# EAGLE design pi3-MotherBoard-rev2 (EAGLE 7.6.0)

## Sheet 1 of 2
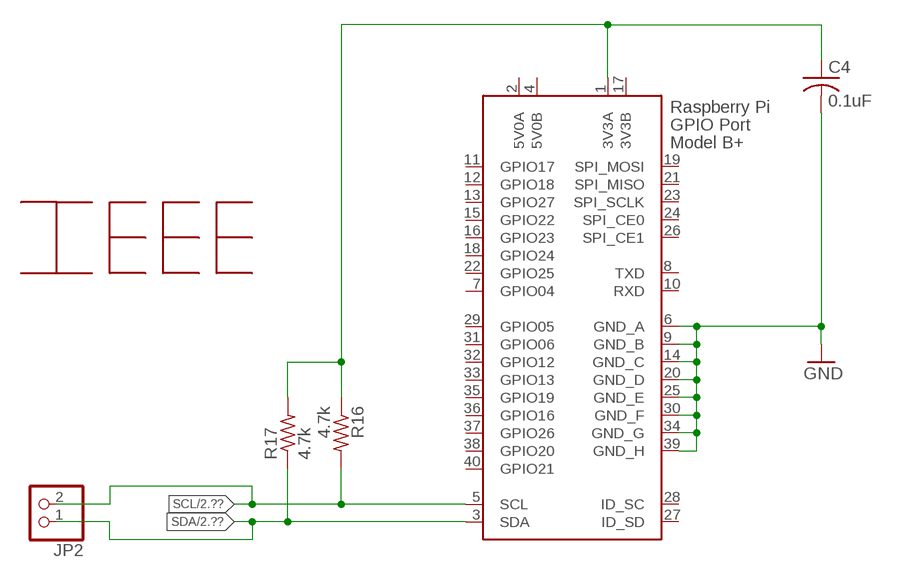
[diagram p0: schematic, sheet 1]

### Parts
C4  0.1uF  C-USC0805  [C0805]
JP2  PINHD-1X2  [1X02]
R16  4.7k  R-US_R1206  [R1206]
R17  4.7k  R-US_R1206  [R1206]
U$1  LOGO  [IEEE-LOGO]
X1  RASPI_BOARD_B+#_FP  [RASPI_BOARD_B+_FULL_PAD]

### Nets
+3V3: C4.1 R16.1 R17.2 X1.1(3V3A) ; also sheet 2
GND: C4.2 X1.6(GND_A) X1.9(GND_B) X1.14(GND_C) X1.20(GND_D) X1.25(GND_E) X1.30(GND_F) X1.34(GND_G) X1.39(GND_H) ; also sheet 2
SCL: JP2.2 R16.2 X1.5(SCL) ; also sheet 2
SDA: JP2.1 R17.1 X1.3(SDA) ; also sheet 2
Unconnected: X1.7(GPIO04) X1.8(TXD) X1.10(RXD) X1.11(GPIO17) X1.12(GPIO18) X1.13(GPIO27) X1.15(GPIO22) X1.16(GPIO23) X1.18(GPIO24) X1.19(SPI_MOSI) X1.21(SPI_MISO) X1.22(GPIO25) X1.23(SPI_SCLK) X1.24(SPI_CE0) X1.26(SPI_CE1) X1.27(ID_SD) X1.28(ID_SC) X1.29(GPIO05) X1.31(GPIO06) X1.32(GPIO12) X1.33(GPIO13) X1.35(GPIO19) X1.36(GPIO16) X1.37(GPIO26) X1.38(GPIO20) X1.40(GPIO21)

## Sheet 2 of 2
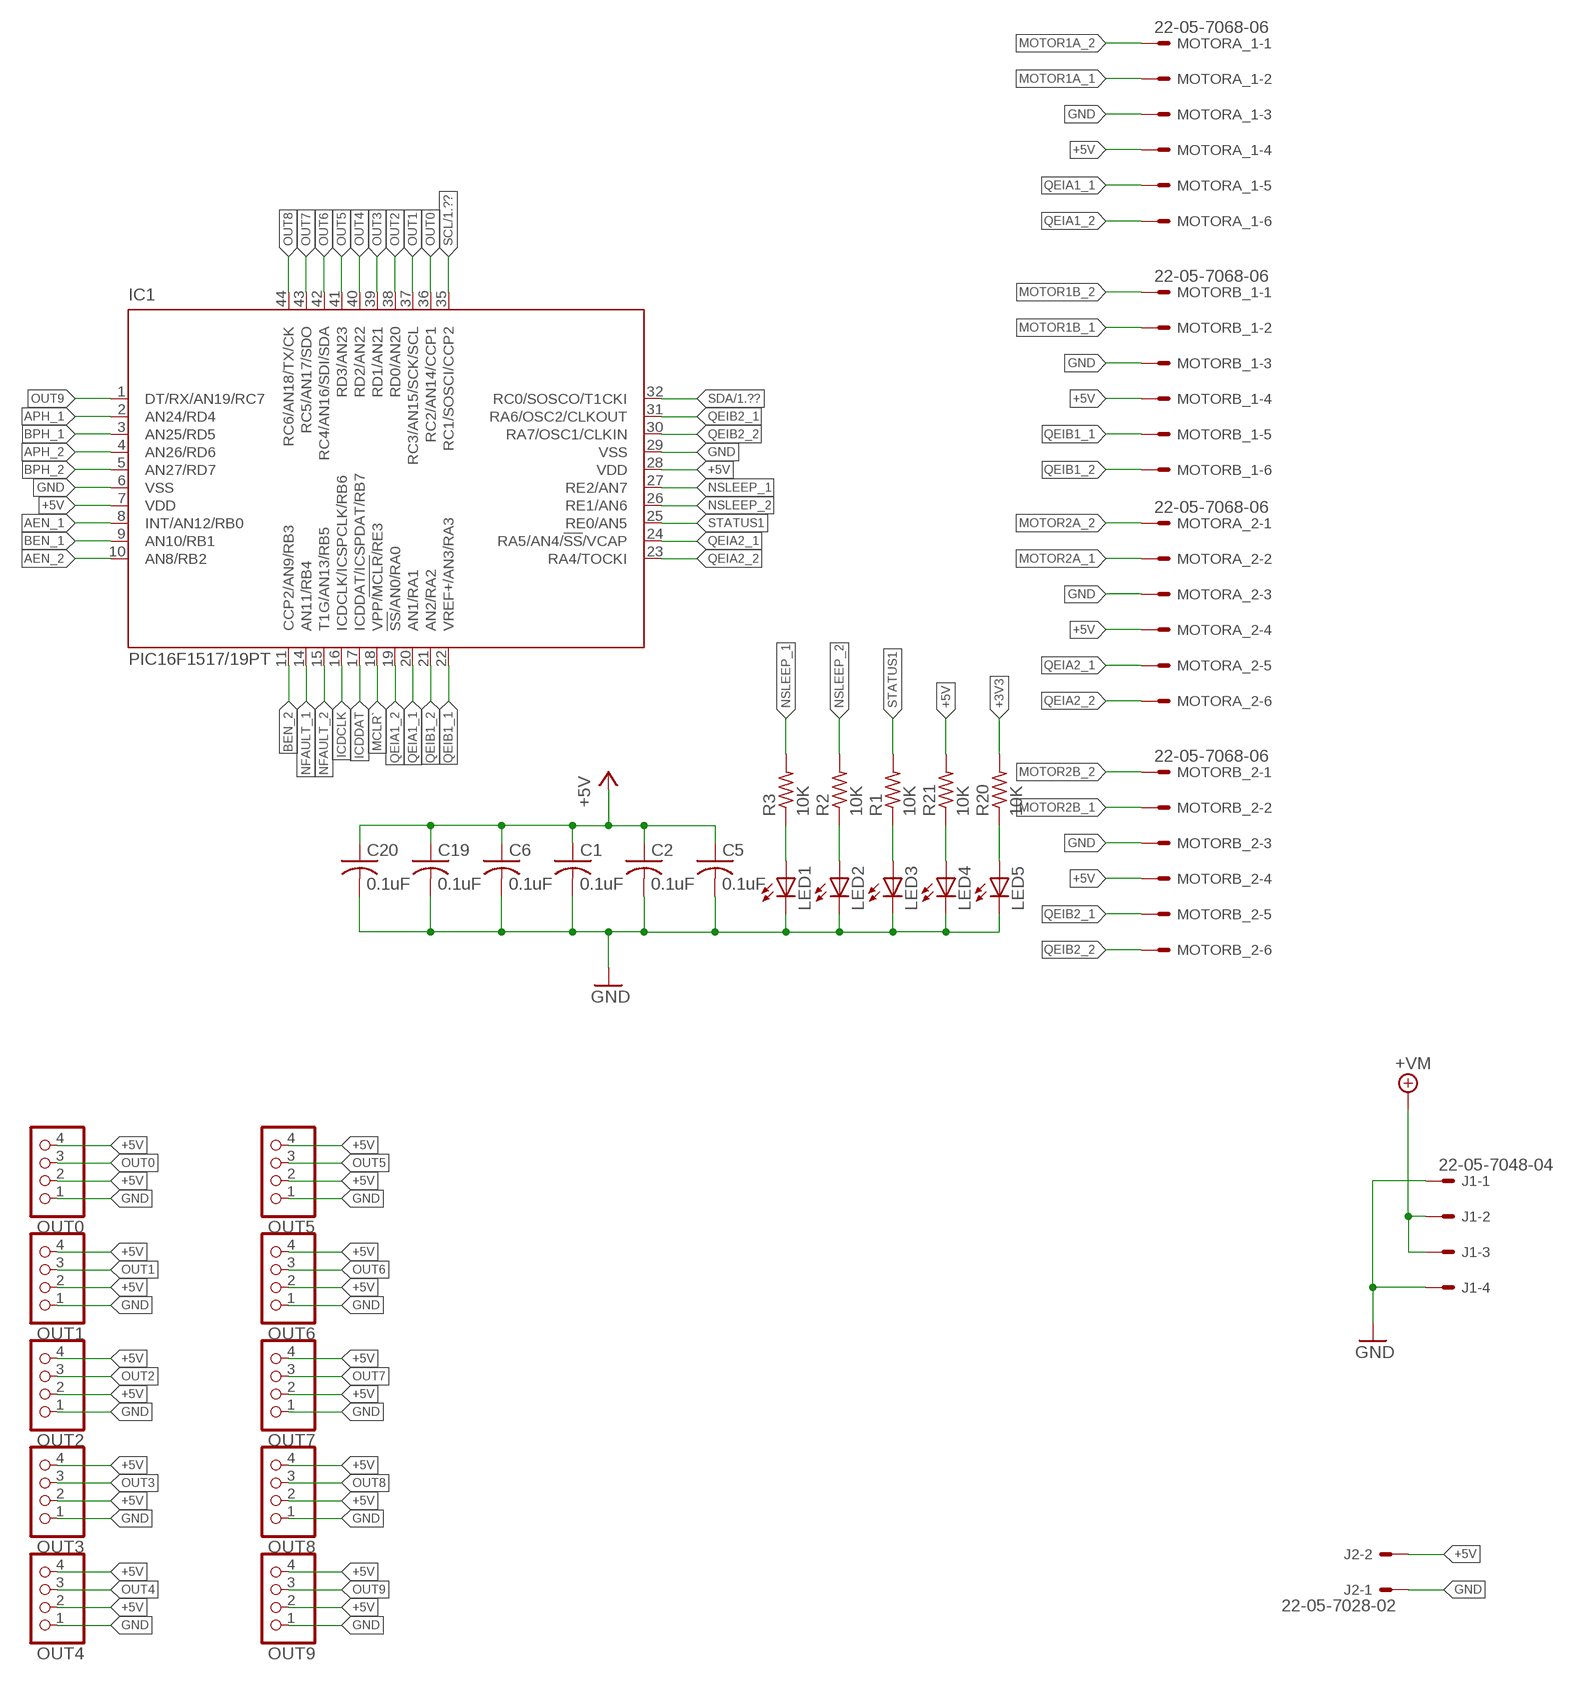
[diagram p1: schematic, sheet 2, part 1 of 2]
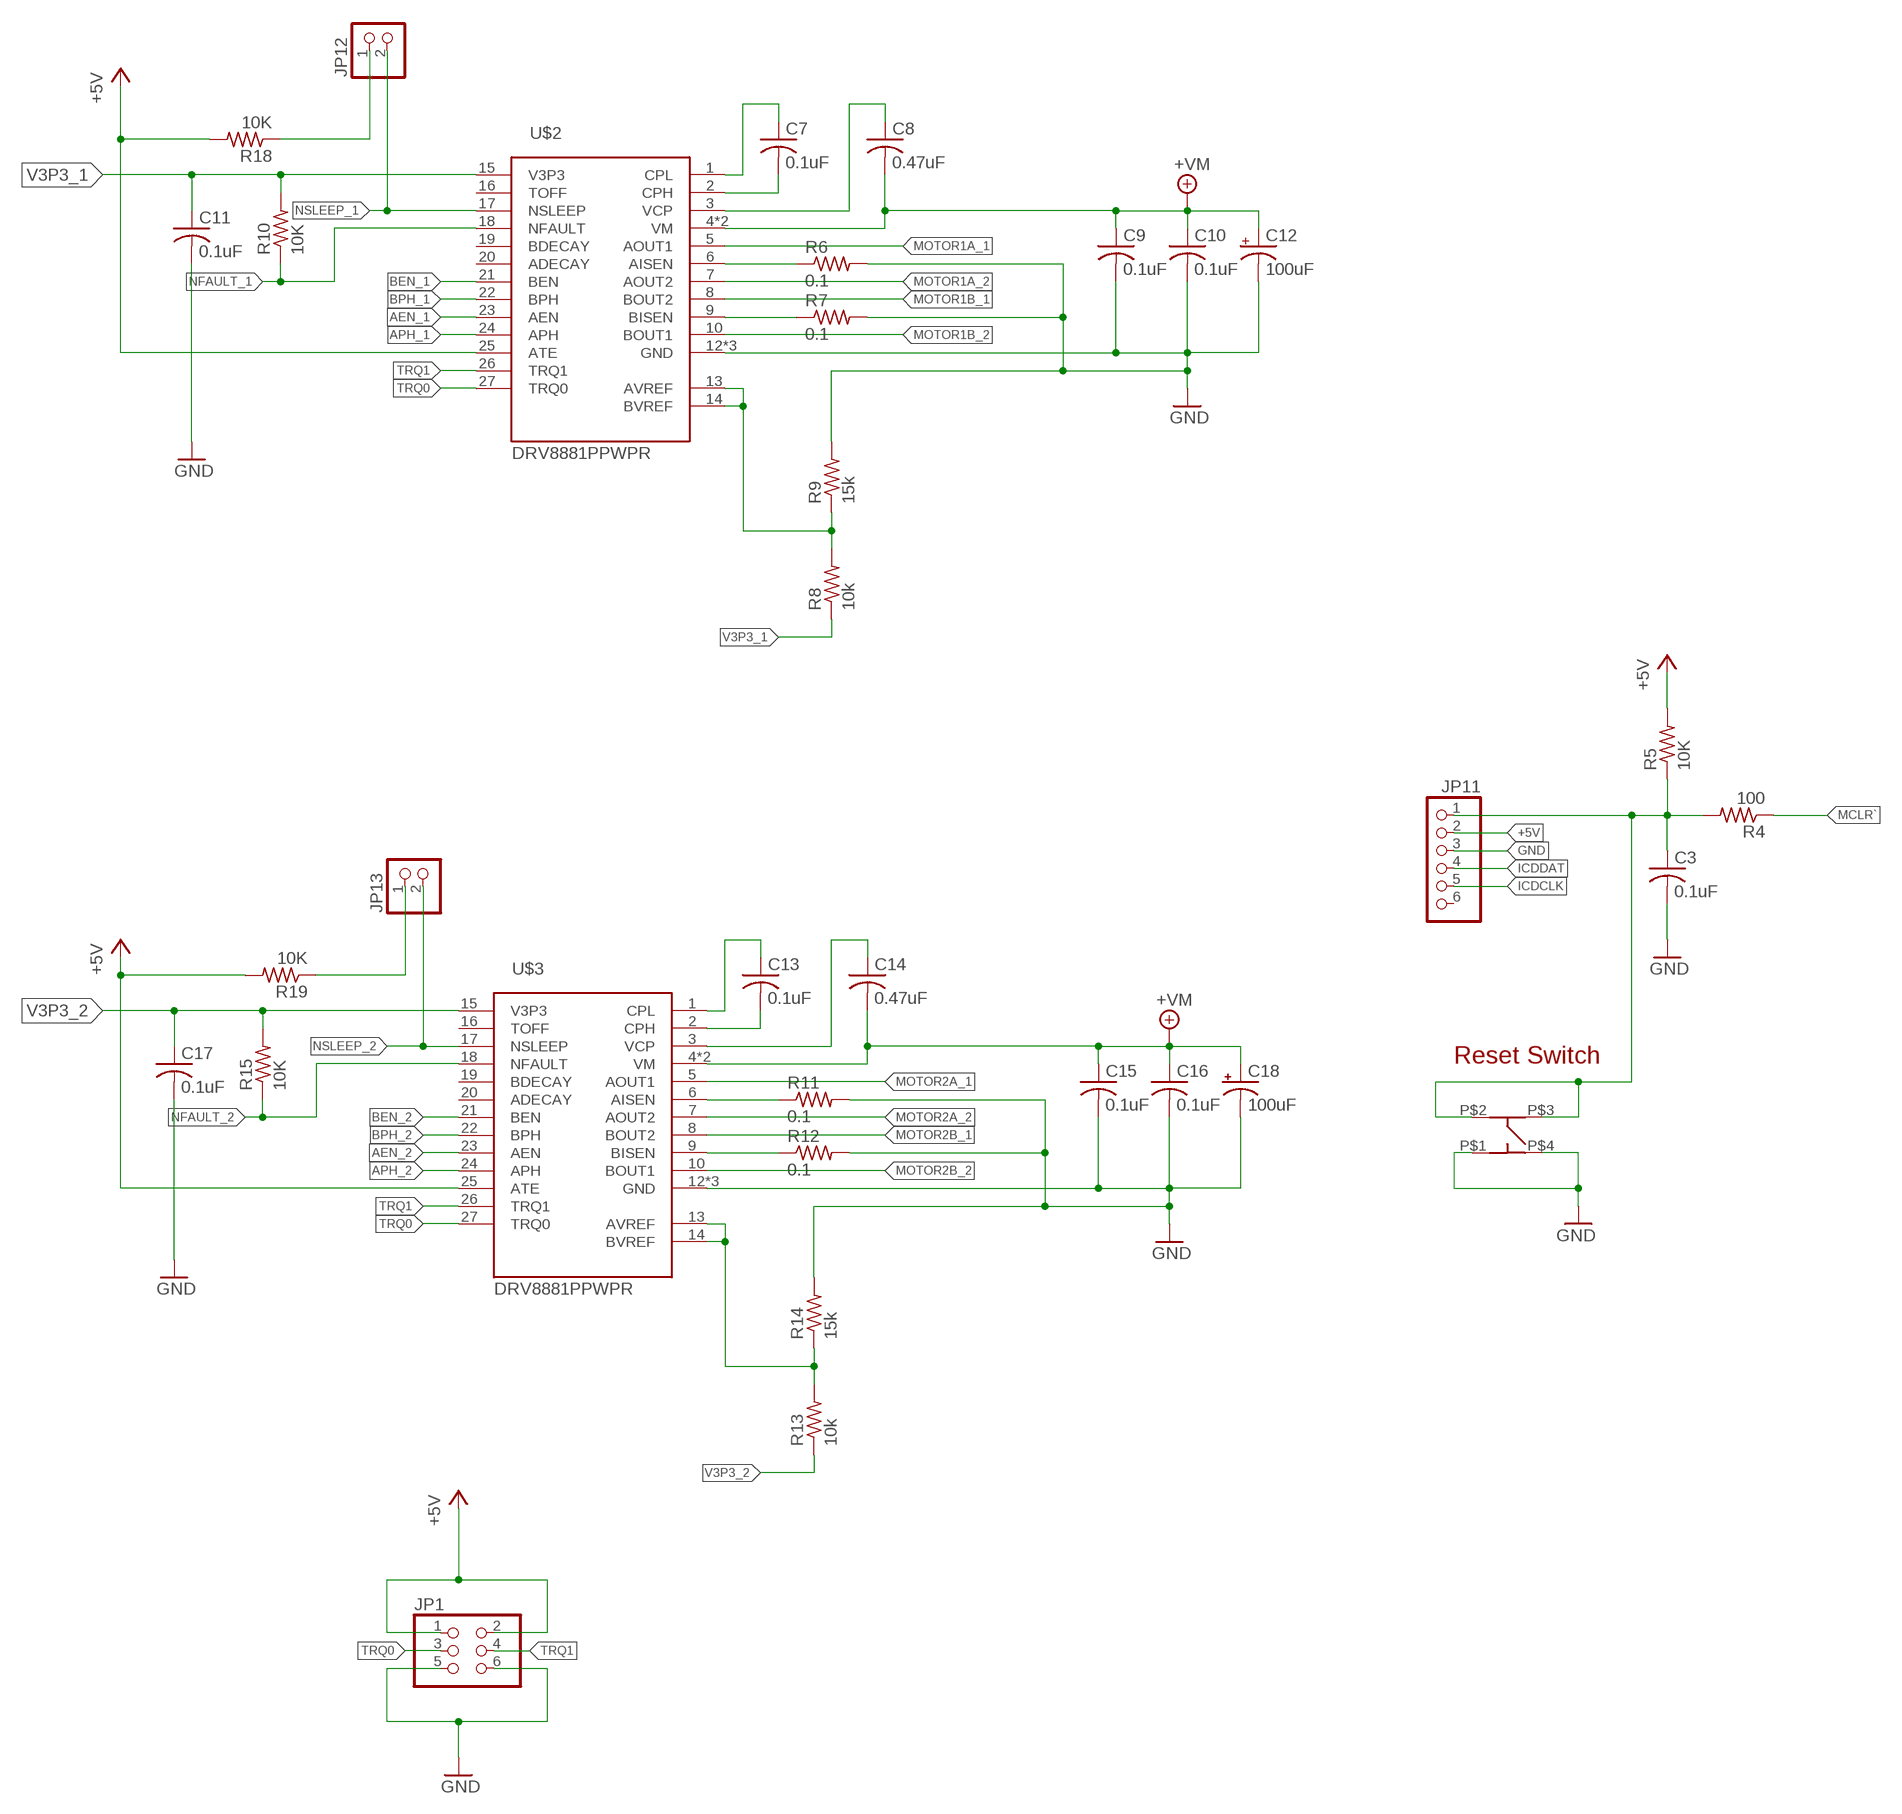
[diagram p2: schematic, sheet 2, part 2 of 2]

### Parts
C1  0.1uF  C-USC0805  [C0805]
C2  0.1uF  C-USC0805  [C0805]
C3  0.1uF  C-USC0805  [C0805]
C5  0.1uF  C-USC0805  [C0805]
C6  0.1uF  C-USC0805  [C0805]
C7  0.1uF  C-USC0402  [C0402]
C8  0.47uF  C-USC0402  [C0402]
C9  0.1uF  C-USC0402  [C0402]
C10  0.1uF  C-USC0402  [C0402]
C11  0.1uF  C-USC0402  [C0402]
C12  100uF  100UF-10V-10%(TANT)  [EIA7343]
C13  0.1uF  C-USC0402  [C0402]
C14  0.47uF  C-USC0402  [C0402]
C15  0.1uF  C-USC0402  [C0402]
C16  0.1uF  C-USC0402  [C0402]
C17  0.1uF  C-USC0402  [C0402]
C18  100uF  100UF-10V-10%(TANT)  [EIA7343]
C19  0.1uF  C-USC0805  [C0805]
C20  0.1uF  C-USC0805  [C0805]
IC1  PIC16F1517/19PT  [TQFP44]
J1  22-05-7048-04  [7395-04]
J2  22-05-7028-02  [7395-02]
JP1  PINHD-2X3  [2X03]
JP11  PINHD-1X6/90  [1X06/90]
JP12  PINHD-1X2  [1X02]
JP13  PINHD-1X2  [1X02]
LED1  LEDSML0603  [SML0603]
LED2  LEDSML0603  [SML0603]
LED3  LEDSML0603  [SML0603]
LED4  LEDSML0603  [SML0603]
LED5  LEDSML0603  [SML0603]
MOTORA_1  22-05-7068-06  [7395-06]
MOTORA_2  22-05-7068-06  [7395-06]
MOTORB_1  22-05-7068-06  [7395-06]
MOTORB_2  22-05-7068-06  [7395-06]
OUT0  PINHD-1X4  [1X04]
OUT1  PINHD-1X4  [1X04]
OUT2  PINHD-1X4  [1X04]
OUT3  PINHD-1X4  [1X04]
OUT4  PINHD-1X4  [1X04]
OUT5  PINHD-1X4  [1X04]
OUT6  PINHD-1X4  [1X04]
OUT7  PINHD-1X4  [1X04]
OUT8  PINHD-1X4  [1X04]
OUT9  PINHD-1X4  [1X04]
R1  10K  R-US_R1206  [R1206]
R2  10K  R-US_R1206  [R1206]
R3  10K  R-US_R1206  [R1206]
R4  100  R-US_R1206  [R1206]
R5  10K  R-US_R1206  [R1206]
R6  0.1  R-US_R1206  [R1206]
R7  0.1  R-US_R1206  [R1206]
R8  10k  R-US_R0402  [R0402]
R9  15k  R-US_R0402  [R0402]
R10  10K  R-US_R1206  [R1206]
R11  0.1  R-US_R1206  [R1206]
R12  0.1  R-US_R1206  [R1206]
R13  10k  R-US_R0402  [R0402]
R14  15k  R-US_R0402  [R0402]
R15  10K  R-US_R1206  [R1206]
R18  10K  R-US_R1206  [R1206]
R19  10K  R-US_R1206  [R1206]
R20  10K  R-US_R1206  [R1206]
R21  10K  R-US_R1206  [R1206]
TOUCH_RESET  RESET  MC32882_SW  [MC32882_FINAL]
U$2  DRV8881PPWPR  [TSSOP-28]
U$3  DRV8881PPWPR  [TSSOP-28]

### Nets
+3V3: R20.2 ; also sheet 1
+5V: C1.1 C2.1 C5.1 C6.1 C19.1 C20.1 IC1.7(VDD) IC1.28(VDD) J2.2 JP1.1 JP1.2 JP11.2 MOTORA_1.4 MOTORA_2.4 MOTORB_1.4 MOTORB_2.4 OUT0.2 OUT0.4 OUT1.2 OUT1.4 OUT2.2 OUT2.4 OUT3.2 OUT3.4 OUT4.2 OUT4.4 OUT5.2 OUT5.4 OUT6.2 OUT6.4 OUT7.2 OUT7.4 OUT8.2 OUT8.4 OUT9.2 OUT9.4 R5.2 R18.2 R19.2 R21.2 U$2.25(ATE) U$3.25(ATE)
+7V [VM]: C8.2 C9.1 C10.1 C12.A(+) C14.2 C15.1 C16.1 C18.A(+) J1.2 J1.3 U$2.4(VM) U$2.11(VM) U$3.4(VM) U$3.11(VM) ; supply symbol labelled +VM
AEN_1: IC1.8(INT/AN12/RB0) U$2.23(AEN)
AEN_2: IC1.10(AN8/RB2) U$3.23(AEN)
APH_1: IC1.2(AN24/RD4) U$2.24(APH)
APH_2: IC1.4(AN26/RD6) U$3.24(APH)
BEN_1: IC1.9(AN10/RB1) U$2.21(BEN)
BEN_2: IC1.11(CCP2/AN9/RB3) U$3.21(BEN)
BPH_1: IC1.3(AN25/RD5) U$2.22(BPH)
BPH_2: IC1.5(AN27/RD7) U$3.22(BPH)
GND: C1.2 C2.2 C3.2 C5.2 C6.2 C9.2 C10.2 C11.2 C12.C(-) C15.2 C16.2 C17.2 C18.C(-) C19.2 C20.2 IC1.6(VSS) IC1.29(VSS) J1.1 J1.4 J2.1 JP1.5 JP1.6 JP11.3 LED1.C LED2.C LED3.C LED4.C LED5.C MOTORA_1.3 MOTORA_2.3 MOTORB_1.3 MOTORB_2.3 OUT0.1 OUT1.1 OUT2.1 OUT3.1 OUT4.1 OUT5.1 OUT6.1 OUT7.1 OUT8.1 OUT9.1 R6.2 R7.2 R9.2 R11.2 R12.2 R14.2 TOUCH_RESET.P$1(P1) TOUCH_RESET.P$4(P4) U$2.12(GND) U$2.28(GND) U$2.EXP(GND) U$3.12(GND) U$3.28(GND) U$3.EXP(GND) ; also sheet 1
ICDCLK: IC1.16(ICDCLK/ICSPCLK/RB6) JP11.5
ICDDAT: IC1.17(ICDDAT/ICSPDAT/RB7) JP11.4
MCLR: C3.1 JP11.1 R4.2 R5.1 TOUCH_RESET.P$2(P2) TOUCH_RESET.P$3(P3)
MCLR`: IC1.18(VPP/!MCLR!/RE3) R4.1
MOTOR1A_1: MOTORA_1.2 U$2.5(AOUT1)
MOTOR1A_2: MOTORA_1.1 U$2.7(AOUT2)
MOTOR1B_1: MOTORB_1.2 U$2.8(BOUT2)
MOTOR1B_2: MOTORB_1.1 U$2.10(BOUT1)
MOTOR2A_1: MOTORA_2.2 U$3.5(AOUT1)
MOTOR2A_2: MOTORA_2.1 U$3.7(AOUT2)
MOTOR2B_1: MOTORB_2.2 U$3.8(BOUT2)
MOTOR2B_2: MOTORB_2.1 U$3.10(BOUT1)
N$1: LED3.A R1.1
N$2: JP12.1 R18.1
N$3: JP13.1 R19.1
N$4: R7.1 U$2.9(BISEN)
N$5: LED5.A R20.1
N$6: LED2.A R2.1
N$7: LED1.A R3.1
N$8: LED4.A R21.1
N$11: R6.1 U$2.6(AISEN)
N$16: C7.2 U$2.2(CPH)
N$17: C7.1 U$2.1(CPL)
N$19: C8.1 U$2.3(VCP)
N$20: R8.2 R9.1 U$2.13(AVREF) U$2.14(BVREF)
N$21: R12.1 U$3.9(BISEN)
N$22: R11.1 U$3.6(AISEN)
N$27: C13.2 U$3.2(CPH)
N$28: C13.1 U$3.1(CPL)
N$29: C14.1 U$3.3(VCP)
N$30: R13.2 R14.1 U$3.13(AVREF) U$3.14(BVREF)
NFAULT_1: IC1.14(AN11/RB4) R10.1 U$2.18(NFAULT)
NFAULT_2: IC1.15(T1G/AN13/RB5) R15.1 U$3.18(NFAULT)
NSLEEP_1: IC1.27(RE2/AN7) JP12.2 R3.2 U$2.17(NSLEEP)
NSLEEP_2: IC1.26(RE1/AN6) JP13.2 R2.2 U$3.17(NSLEEP)
OUT0: IC1.36(RC2/AN14/CCP1) OUT0.3
OUT1: IC1.37(RC3/AN15/SCK/SCL) OUT1.3
OUT2: IC1.38(RD0/AN20) OUT2.3
OUT3: IC1.39(RD1/AN21) OUT3.3
OUT4: IC1.40(RD2/AN22) OUT4.3
OUT5: IC1.41(RD3/AN23) OUT5.3
OUT6: IC1.42(RC4/AN16/SDI/SDA) OUT6.3
OUT7: IC1.43(RC5/AN17/SDO) OUT7.3
OUT8: IC1.44(RC6/AN18/TX/CK) OUT8.3
OUT9: IC1.1(DT/RX/AN19/RC7) OUT9.3
QEIA1_1: IC1.20(AN1/RA1) MOTORA_1.5
QEIA1_2: IC1.19(!SS!/AN0/RA0) MOTORA_1.6
QEIA2_1: IC1.24(RA5/AN4/!SS!/VCAP) MOTORA_2.5
QEIA2_2: IC1.23(RA4/TOCKI) MOTORA_2.6
QEIB1_1: IC1.22(VREF+/AN3/RA3) MOTORB_1.5
QEIB1_2: IC1.21(AN2/RA2) MOTORB_1.6
QEIB2_1: IC1.31(RA6/OSC2/CLKOUT) MOTORB_2.5
QEIB2_2: IC1.30(RA7/OSC1/CLKIN) MOTORB_2.6
SCL: IC1.35(RC1/SOSCI/CCP2) ; also sheet 1
SDA: IC1.32(RC0/SOSCO/T1CKI) ; also sheet 1
STATUS1: IC1.25(RE0/AN5) R1.2
TRQ0: JP1.3 U$2.27(TRQ0) U$3.27(TRQ0)
TRQ1: JP1.4 U$2.26(TRQ1) U$3.26(TRQ1)
V3P3_1: C11.1 R8.1 R10.2 U$2.15(V3P3)
V3P3_2: C17.1 R13.1 R15.2 U$3.15(V3P3)
Unconnected: JP11.6 U$2.16(TOFF) U$2.19(BDECAY) U$2.20(ADECAY) U$3.16(TOFF) U$3.19(BDECAY) U$3.20(ADECAY)

### Notes on the sheet
- Reset Switch

## Power pins joined to a net without a drawn wire
3V3B: X1.17(3V3B)
5V0A: X1.2(5V0A)
5V0B: X1.4(5V0B)

## Library data of the parts
C1-C11 C13-C17 C19 C20 = rcl:C-US: CAPACITOR, American symbol
C12 C18 = SparkFun-Capacitors:100UF-10V-10%(TANT): CAP-07890; PROD_ID: CAP-07890
IC1 = microchip:PIC16*F1517/19: 28/40/44-Pin Flash Microcontrollers with nanoWatt XLP Technology PIC16F1517/1519 AND PIC16LF1517/1519 Source: www.microchip.com PIC16F1516.pdf
J1 = con-molex:22-?-04: CONNECTOR wire to board 2.54 mm (.1 inch) pitch header; OC_FARNELL: unknown; OC_NEWARK: unknown
J2 = con-molex:22-?-02: CONNECTOR wire to board 2.54 mm (.1 inch) pitch header; OC_FARNELL: 9731601; OC_NEWARK: unknown
JP1 = pinhead:PINHD-2X3: PIN HEADER
JP2 JP12 JP13 = pinhead:PINHD-1X2: PIN HEADER
JP11 = pinhead:PINHD-1X6: PIN HEADER
LED1-LED5 = interface_board-rev13:LED: LED OSRAM: - CHIPLED LG R971, LG N971, LY N971, LG Q971, LY Q971, LO R971, LY R971 LH N974, LH R974 LS Q976, LO Q976, LY Q976 LO Q996 - Hyper CHIPLED LW Q18S LB Q993, LB Q99A, LB R99A - SideLED LS A670, LO A670, LY A670, LG A670, LP A670 LB A673, LV A673, LT A673, LW A673 LH A674 LY A675 LS A676, LA A676, LO A676, LY A676, LW A676 LS A679, LY A679, LG A679 - Hyper Micro SIDELED® LS Y876, LA Y876, LO Y876, LY Y876 LT Y87S - SmartLED LW L88C, LW L88S LB L89C, LB L89S, LG L890 LS L89K, LO L89K, LY L89K LS L896, LA L896, LO L896, LY L896 - TOPLED LS T670, LO T670, LY T670, LG T670, LP T670 LSG T670, LSP T670, LSY T670, LOP T670, LYG T670 LG T671, LOG T671, LSG T671 LB T673, LV T673, LT T673, LW T673 LH T674 LS T676, LA T676, LO T676, LY T676, LB T676, LH T676, LSB T676, LW T676 LB T67C, LV T67C, LT T67C, LS T67K, LO T67K, LY T67K, LW E67C LS E67B, LA E67B, LO E67B, LY E67B, LB E67C, LV E67C, LT E67C LW T67C LS T679, LY T679, LG T679 LS T770, LO T770, LY T770, LG T770, LP T770 LB T773, LV T773, LT T773, LW T773 LH T774 LS E675, LA E675, LY E675, LS T675 LS T776, LA T776, LO T776, LY T776, LB T776 LHGB T686 LT T68C, LB T68C - Hyper Mini TOPLED® LB M676 - Mini TOPLED Santana® LG M470 LS M47K, LO M47K, LY M47K Source: http://www.osram.convergy.de LUXEON: - LUMILED® LXK2-PW12-R00, LXK2-PW12-S00, LXK2-PW14-U00, LXK2-PW14-V00 LXK2-PM12-R00, LXK2-PM12-S00, LXK2-PM14-U00 LXK2-PE12-Q00, LXK2-PE12-R00, LXK2-PE12-S00, LXK2-PE14-T00, LXK2-PE14-U00 LXK2-PB12-K00, LXK2-PB12-L00, LXK2-PB12-M00, LXK2-PB14-N00, LXK2-PB14-P00, LXK2-PB14-Q00 LXK2-PR12-L00, LXK2-PR12-M00, LXK2-PR14-Q00, LXK2-PR14-R00 LXK2-PD12-Q00, LXK2-PD12-R00, LXK2-PD12-S00 LXK2-PH12-R00, LXK2-PH12-S00 LXK2-PL12-P00, LXK2-PL12-Q00, LXK2-PL12-R00 Source: www.luxeon.com KINGBRIGHT: KA-3528ASYC Source: www.kingbright.com
MOTORA_1 MOTORA_2 MOTORB_1 MOTORB_2 = con-molex:22-?-06: CONNECTOR wire to board 2.54 mm (.1 inch) pitch header; OC_FARNELL: unknown; OC_NEWARK: unknown
OUT0 OUT1-OUT9 = pinhead:PINHD-1X4: PIN HEADER
R1-R21 = rcl:R-US_: RESISTOR, American symbol
TOUCH_RESET = power_lib:MC32882_SW
U$1 = IEEE-logo:LOGO
U$2 U$3 = motor-driver:DRV8881PPWPR
X1 = Pi3_motor_hat_rev1:RASPI_BOARD_B+#: Raspberry Pi GPIO connector with markings for the outer dimensions of the Raspberry Pi board model B+ with different sets of drill holes or mounting pads All pins connected

## Net classes
2 VM: width 0.508 mm, drill 0.33 mm, clearance 0.254 mm
3 gnd: width 0.152 mm

## Board
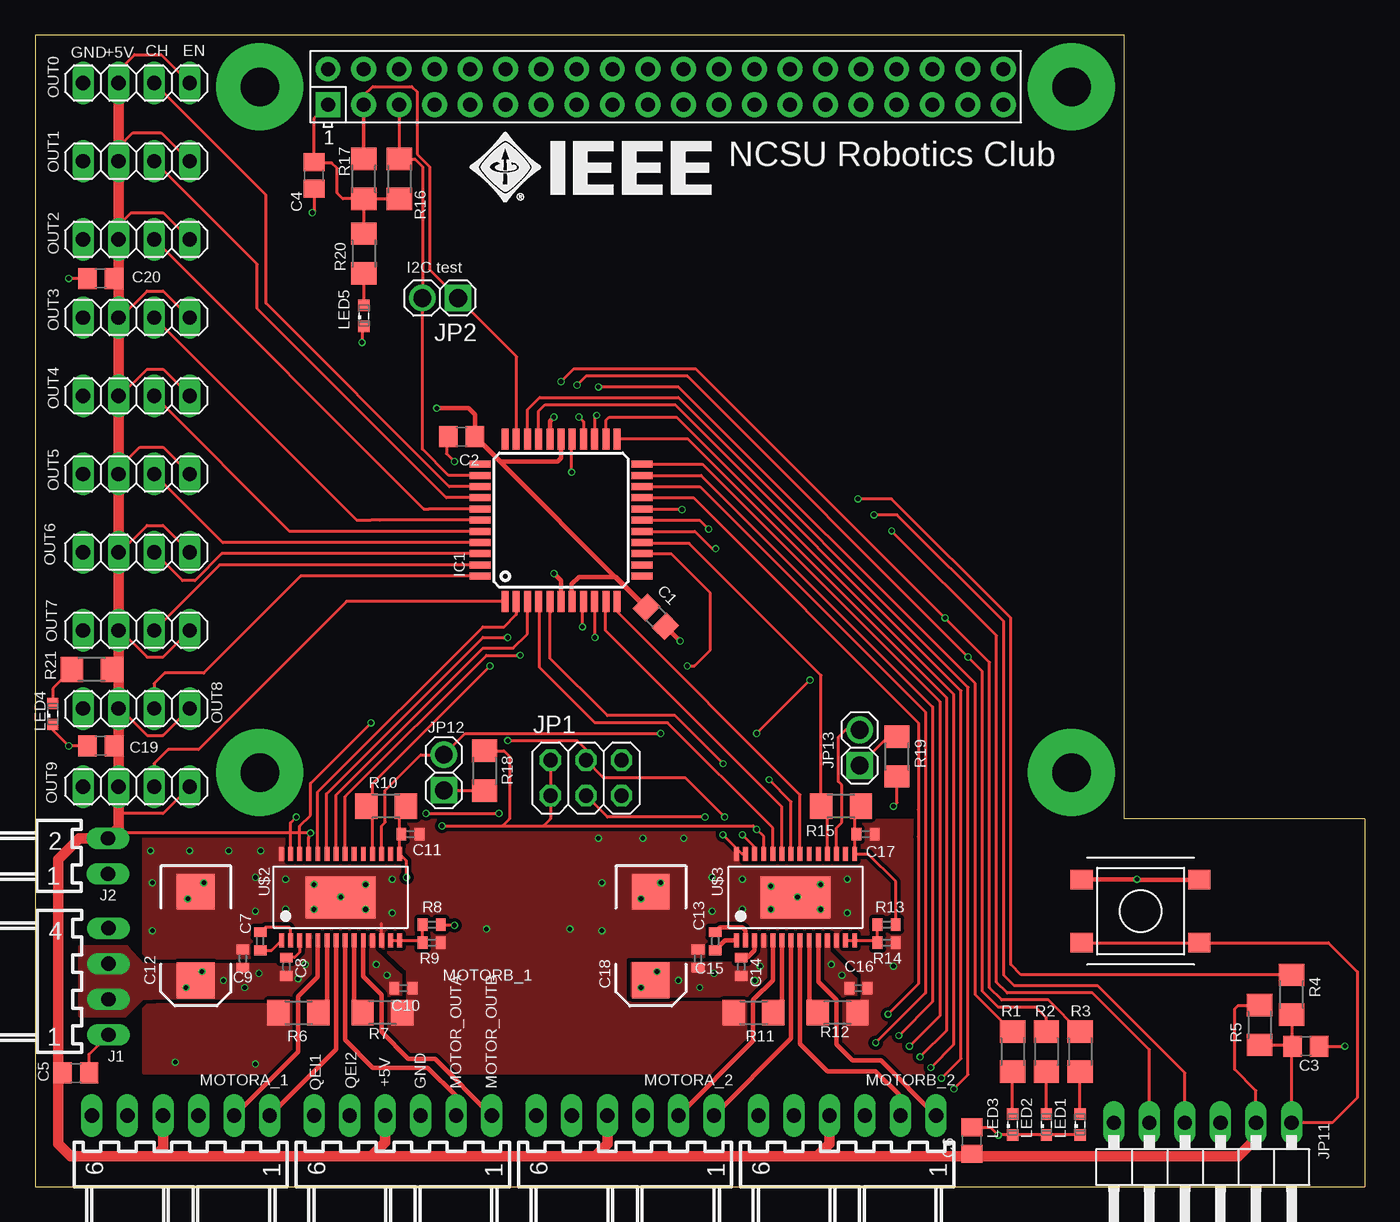
[diagram p3: board, top side]
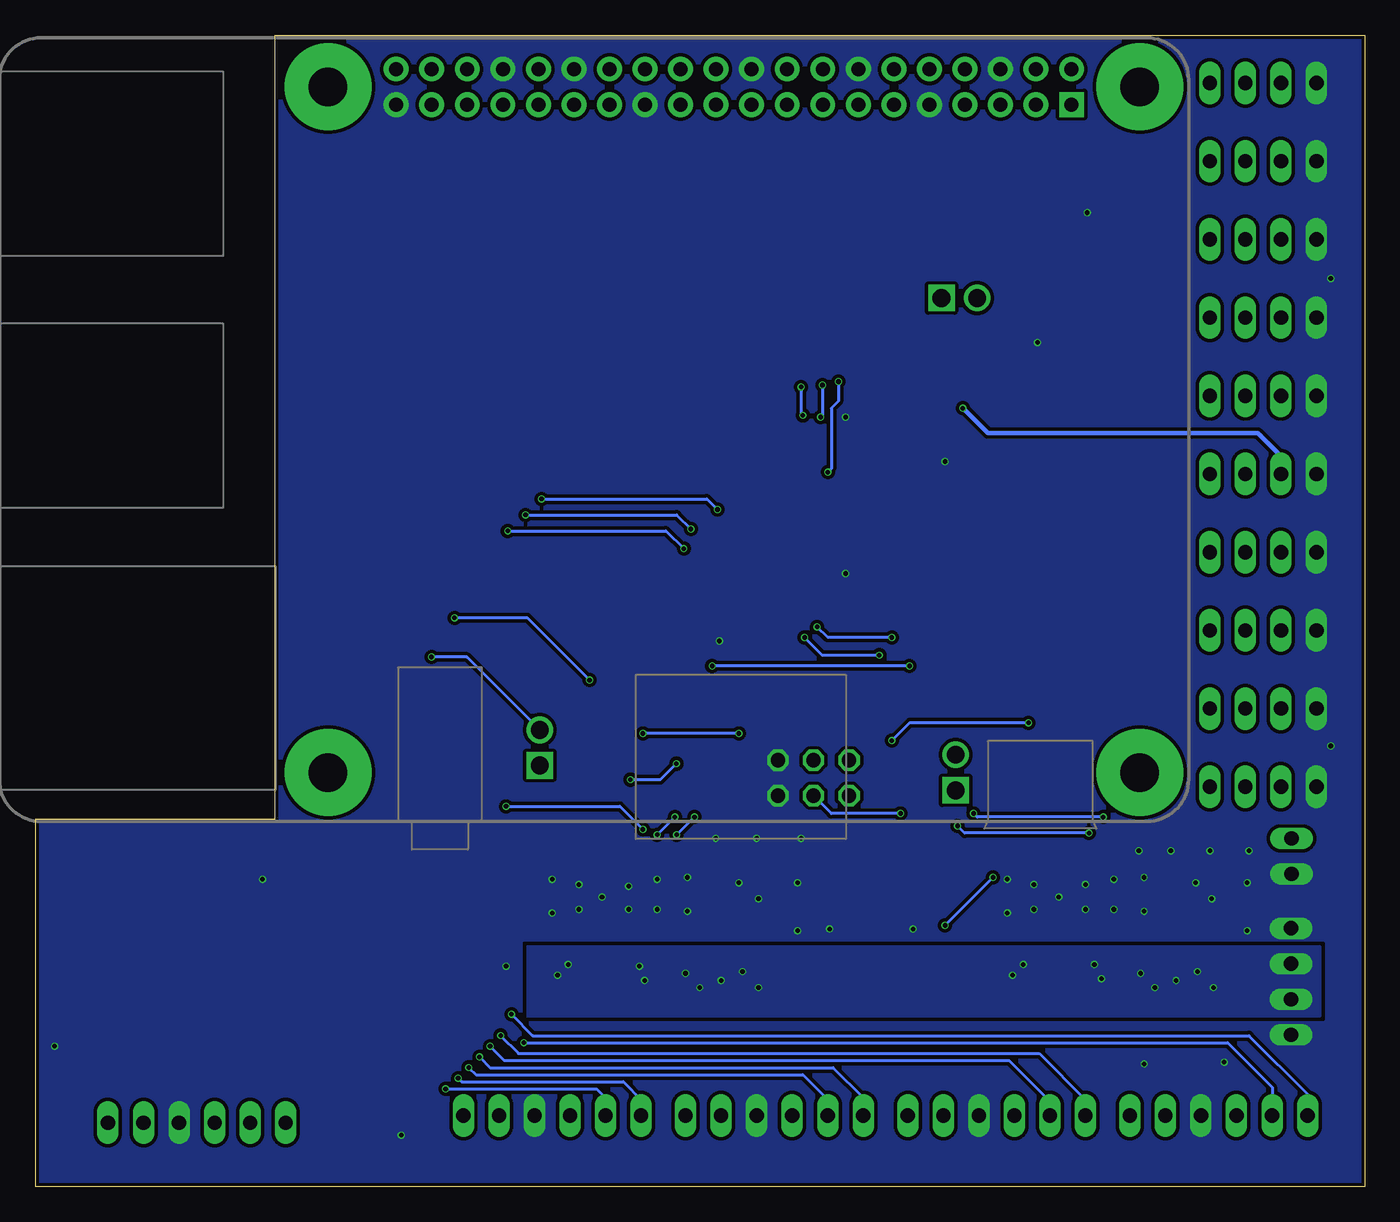
[diagram p4: board, bottom side, seen from below]

Size 95 x 82.3 mm. Coordinates in mm from the lower left corner, seen from the top.
Outline: 0,0 95,0 95,26.29 77.85,26.29 77.85,82.3 0,82.3 0,0
Copper layers (1*16): Top 0.035mm / dielectric 1.5mm / Bottom 0.035mm
Design rules "EagleRules-2-Layer-Shep": minimum track width 6mil, minimum drill 12mil, track to track 6mil, track to pad 6mil, pad to pad 6mil, via to via 6mil, smd to smd 0mil, copper to edge 10mil, drill to drill 10mil, minimum pad ring 2mil, minimum via ring 2mil, stop-mask expansion 2mil, vias tented up to drill 100mil, thermal gap 10mil

### Footprints (pad centres in the part's own frame; a part is rotated, then mirrored left to right if it is on the bottom)
C0805 = smd 1.3 x 1.5: 1 -0.95,0; 2 0.95,0
C0402 = smd 0.7 x 0.9: 1 -0.65,0; 2 0.65,0
EIA7343 = smd 2.55 x 2.7: A 3.17,0; C -3.17,0
TQFP44 = smd 1.5 x 0.5: 1 -5.8,4; 2 -5.8,3.2; 3 -5.8,2.4; 4 -5.8,1.6; 5 -5.8,0.8; 6 -5.8,0; 7 -5.8,-0.8; 8 -5.8,-1.6; 9 -5.8,-2.4; 10 -5.8,-3.2; 11 -5.8,-4; 23 5.8,-4; 24 5.8,-3.2; 25 5.8,-2.4; 26 5.8,-1.6; 27 5.8,-0.8; 28 5.8,0; 29 5.8,0.8; 30 5.8,1.6; 31 5.8,2.4; 32 5.8,3.2; 33 5.8,4 | smd 0.5 x 1.5: 12 -4,-5.8; 13 -3.2,-5.8; 14 -2.4,-5.8; 15 -1.6,-5.8; 16 -0.8,-5.8; 17 0,-5.8; 18 0.8,-5.8; 19 1.6,-5.8; 20 2.4,-5.8; 21 3.2,-5.8; 22 4,-5.8; 34 4,5.8; 35 3.2,5.8; 36 2.4,5.8; 37 1.6,5.8; 38 0.8,5.8; 39 0,5.8; 40 -0.8,5.8; 41 -1.6,5.8; 42 -2.4,5.8; 43 -3.2,5.8; 44 -4,5.8
7395-04 = drill 1.016 long: 1 3.81,0; 2 1.27,0; 3 -1.27,0; 4 -3.81,0
7395-02 = drill 1.016 long: 1 1.27,0; 2 -1.27,0
2X03 = drill 1.016 octagon: 1 -2.54,-1.27; 2 -2.54,1.27; 3 0,-1.27; 4 0,1.27; 5 2.54,-1.27; 6 2.54,1.27
1X02 = drill 1.27 square: 1 -1.27,0 | drill 1.27: 2 1.27,0
1X06/90 = drill 1.016 long: 1 -6.35,-3.81; 2 -3.81,-3.81; 3 -1.27,-3.81; 4 1.27,-3.81; 5 3.81,-3.81; 6 6.35,-3.81
SML0603 = smd 0.8 x 0.8: A 0.75,0; C -0.75,0
7395-06 = drill 1.016 long: 1 6.35,0; 2 3.81,0; 3 1.27,0; 4 -1.27,0; 5 -3.81,0; 6 -6.35,0
1X04 = drill 1.016 long: 1 -3.81,0; 2 -1.27,0; 3 1.27,0; 4 3.81,0
R1206 = smd 1.6 x 1.803: 1 -1.422,0; 2 1.422,0
R0402 = smd 0.7 x 0.9: 1 -0.65,0; 2 0.65,0
MC32882_FINAL = smd 1.6 x 1.4: P$1 -4.2,-2.25; P$2 -4.2,2.25; P$3 4.2,2.25; P$4 4.2,-2.25
TSSOP-28 = smd 0.35 x 1: 1 -4.225,-3.087; 2 -3.575,-3.087; 3 -2.925,-3.087; 4 -2.275,-3.087; 5 -1.625,-3.087; 6 -0.975,-3.087; 7 -0.325,-3.087; 8 0.325,-3.087; 9 0.975,-3.087; 10 1.625,-3.087; 11 2.275,-3.087; 12 2.925,-3.087; 13 3.575,-3.087; 14 4.225,-3.087; 15 4.225,3.087; 16 3.575,3.087; 17 2.925,3.087; 18 2.275,3.087; 19 1.625,3.087; 20 0.975,3.087; 21 0.325,3.087; 22 -0.325,3.087; 23 -0.975,3.087; 24 -1.625,3.087; 25 -2.275,3.087; 26 -2.925,3.087; 27 -3.575,3.087; 28 -4.225,3.087 | smd 5 x 3: EXP 0,0
RASPI_BOARD_B+_FULL_PAD = drill 1 pad 1.778 square: 1 8.37,51.23 | drill 1 pad 1.778: 2 8.37,53.77; 3 10.91,51.23; 4 10.91,53.77; 5 13.45,51.23; 6 13.45,53.77; 7 15.99,51.23; 8 15.99,53.77; 9 18.53,51.23; 10 18.53,53.77; 11 21.07,51.23; 12 21.07,53.77; 13 23.61,51.23; 14 23.61,53.77; 15 26.15,51.23; 16 26.15,53.77; 17 28.69,51.23; 18 28.69,53.77; 19 31.23,51.23; 20 31.23,53.77; 21 33.77,51.23; 22 33.77,53.77; 23 36.31,51.23; 24 36.31,53.77; 25 38.85,51.23; 26 38.85,53.77; 27 41.39,51.23; 28 41.39,53.77; 29 43.93,51.23; 30 43.93,53.77; 31 46.47,51.23; 32 46.47,53.77; 33 49.01,51.23; 34 49.01,53.77; 35 51.55,51.23; 36 51.55,53.77; 37 54.09,51.23; 38 54.09,53.77; 39 56.63,51.23; 40 56.63,53.77 | drill 2.75 pad 6.2: DRILL_1 3.5,52.5; DRILL_2 61.5,52.5; DRILL_3 3.5,3.5; DRILL_4 61.5,3.5

### Placement (x,y rotation side)
C1  44.37,40.71 315 top
C2  30.48,53.59 180 top
C3  90.81,10.03 0 top
C4  19.94,72.26 270 top
C5  2.92,8.13 0 top
C6  66.93,3.3 90 top
C7  16.09,17.54 90 top
C8  17.96,15.71 270 top
C9  14.86,16.3 90 top
C10  26.32,14.18 0 top
C11  26.83,25.18 0 top
C12  11.49,17.91 270 top
C13  48.61,17.54 90 top
C14  50.47,15.71 270 top
C15  47.37,16.3 90 top
C16  58.84,14.18 0 top
C17  59.34,25.18 0 top
C18  44,17.91 270 top
C19  4.7,31.5 180 top
C20  4.7,64.9 180 top
IC1  37.59,47.62 90 top
J1  5.25,14.66 270 top
J2  5.21,23.62 270 top
JP1  39.37,29.21 0 top
JP2  28.96,63.5 180 top
JP11  83.44,0.76 180 top
JP12  29.21,29.59 90 top
JP13  58.93,31.37 90 top
LED1  74.68,4.45 90 top
LED2  72.26,4.45 90 top
LED3  69.85,4.45 90 top
LED4  1.27,33.78 90 top
LED5  23.5,62.23 90 top
MOTORA_1  10.41,5.08 0 top
MOTORA_2  42.16,5.08 0 top
MOTORB_1  26.29,5.08 0 top
MOTORB_2  58.04,5.08 0 top
OUT0  7.24,78.87 0 top
OUT1  7.24,73.28 0 top
OUT2  7.24,67.69 0 top
OUT3  7.24,62.1 0 top
OUT4  7.24,56.52 0 top
OUT5  7.24,50.93 0 top
OUT6  7.24,45.34 0 top
OUT7  7.24,39.75 0 top
OUT8  7.24,34.16 0 top
OUT9  7.24,28.57 0 top
R1  69.85,9.65 90 top
R2  72.26,9.65 90 top
R3  74.68,9.65 90 top
R4  89.79,13.72 270 top
R5  87.5,11.56 90 top
R6  18.83,12.43 180 top
R7  24.83,12.43 0 top
R8  28.34,18.73 180 top
R9  28.34,17.44 0 top
R10  25.09,27.18 0 top
R11  51.34,12.43 180 top
R12  57.34,12.43 0 top
R13  60.86,18.73 180 top
R14  60.86,17.44 0 top
R15  57.6,27.18 0 top
R16  26.04,72.01 90 top
R17  23.5,72.01 270 top
R18  32.13,29.72 90 top
R19  61.59,30.73 270 top
R20  23.5,66.67 90 top
R21  4.06,36.96 0 top
TOUCH_RESET  78.99,19.68 180 top
U$1  39.24,72.77 0 top
U$2  21.84,20.68 0 top
U$3  54.35,20.68 0 top
X1  12.56,26.1 0 top

### Tracks (layer width: path | path; a pad name or v marks a point on that pad's centre or on a via)
+3V3
  Top 0.203: X1.1 19.94,76.33 C4.1 20,73.15 21.21,73.15 21.59,72.77 21.59,70.99 22,70.59 R17.2 | R17.2 R16.1 | R17.2 R20.2
+5V  (via drill 0.33)
  Top 0.203: OUT0.2 5.97,79.76 7.11,80.9 9.02,80.9 OUT0.4 | OUT1.2 5.97,74.3 6.99,75.31 9.02,75.31 OUT1.4 | OUT2.2 5.97,68.71 6.86,69.6 9.14,69.6 OUT2.4 | OUT3.2 6.1,62.1 8,64.01 9.14,64.01 OUT3.4 | OUT4.2 6.1,56.52 8,58.42 9.14,58.42 OUT4.4 | OUT5.2 5.97,51.31 7.49,52.83 9.14,52.83 OUT5.4 | OUT6.2 6.1,45.34 8,47.24 9.14,47.24 OUT6.4 | OUT7.2 6.1,39.75 8,37.85 9.14,37.85 OUT7.4 | OUT8.2 6.1,34.16 8,32.26 9.14,32.26 OUT8.4 | OUT9.4 9.14,26.67 5.97,26.67 | v29.08,25.78 33.4,25.78 | 33.4,25.78 36.32,25.78 | 36.32,25.78 51.31,25.78 v51.56,25.53 52.07,25.02 U$3.25 | U$2.25 19.56,24.89 v19.68,25.27 5.59,25.27 | JP11.2 87.25,6.86 85.72,8.38 85.72,12.7 85.98,12.95 87.48,12.95 R5.2 | C6.1 66.61,2.35 66.42,2.16 | C5.1 1.78,8.13 1.65,8 | C19.1 5.97,31.5 | C20.1 5.97,64.9 | R18.2 33.5,31.14 33.91,30.73 33.91,26.29 33.4,25.78 | v61.34,27.18 61.59,27.43 R19.2 | R21.2 5.61,36.83 5.97,36.83 | JP1.1 JP1.2 36.83,26.29 36.32,25.78
  Top 0.305: IC1.7 38.35,41.86 38.35,43.05 38.86,43.56 41.53,43.56 C1.1 43.64,41.39 C2.1 | C2.1 31.5,53.59 33.27,51.82 37.34,51.82 37.59,52.07 IC1.28 | C2.1 31.43,55.18 30.99,55.63
  Top 0.33: 30.99,55.63 v28.7,55.63
  Top 0.762: OUT0.2 OUT1.2 OUT2.2 5.97,64.9 OUT3.2 OUT4.2 OUT5.2 OUT6.2 OUT7.2 5.97,36.83 OUT8.2 5.97,31.5 OUT9.2 5.97,26.67 5.97,25.65 5.59,25.27 J2.2 3.17,24.89 1.65,23.37 1.65,8 1.65,3.05 2.54,2.16 8.51,2.16 | 8.51,2.16 24,2.16 | 24,2.16 40.01,2.16 | 40.01,2.16 55.88,2.16 | 55.88,2.16 56.77,3.05 MOTORB_2.4 | MOTORA_2.4 40.89,3.05 40.01,2.16 | MOTORB_1.4 25.02,3.17 24,2.16 | MOTORA_1.4 9.14,2.79 8.51,2.16 | JP11.2 87.25,3.43 85.98,2.16 66.42,2.16 55.88,2.16
  Bottom 0.203: v19.68,25.27 28.57,25.27 v29.08,25.78 | v61.34,27.18 53.21,27.18 v51.56,25.53
  Bottom 0.305: 23.5,53.85 7.62,53.85 5.97,52.2 OUT5.2
  Bottom 0.33: v28.7,55.63 26.92,53.85 23.5,53.85
+7V  (via drill 0.33)
  other vias: 56.9,15.88 57.66,15.11 51.82,15.75 51.44,14.73 47.5,14.22 48.51,15.24 43.31,14.22 44.45,15.37 45.97,14.73 24.38,15.88 25.15,15.11 19.3,15.88 18.8,14.86 16,15.24 14.99,14.22 13.46,14.73 11.94,15.37 10.79,14.22
  pour Top (isolate 0.254, no thermals): 19.3,18.03 20.07,18.03 20.07,14.86 19.94,14.86 18.54,13.46 7.75,13.46 7.75,15.88 18.41,15.88 19.3,16.76
  pour Top (isolate 0.254, no thermals): 23.88,17.91 23.88,14.48 24.77,13.59 26.16,13.59 26.16,15.11 24.26,16.89 24.26,17.91
  pour Top (isolate 0.254, no thermals): 8.38,15.88 7.75,15.88 6.6,17.14 3.17,17.14 3.17,12.19 6.48,12.19 7.75,13.46 8.38,13.46
  pour Top (isolate 0.254, no thermals): 42.67,16 50.8,16 51.82,17.02 51.82,17.91 52.32,17.91 52.32,14.86 51.05,13.59 42.67,13.59
  pour Top (isolate 0.254, no thermals): 56.26,17.91 56.26,14.35 57.02,13.59 58.67,13.59 58.67,14.86 56.77,16.76 56.77,17.91
  pour Bottom (isolate 0.254, no thermals): 3.17,17.14 59.82,17.14 59.82,12.19 3.17,12.19
AEN_1  (via drill 0.33)
  Top 0.203: U$2.23 20.83,23.8 20.83,28.07 32,39.24 v33.78,39.24 33.53,39.24 | v39.12,40.01 39.12,41.75 IC1.8
  Bottom 0.203: v33.78,39.24 38.35,39.24 v39.12,40.01
AEN_2
  Top 0.203: 40.77,41.8 IC1.10 40.89,41.72 40.89,41.27 40.77,41.15 40.77,39.75 53.37,27.14 U$3.23
APH_1
  Top 0.203: U$2.24 20.21,28.21 32,40.01 33.53,40.01 34.39,40.87 IC1.2
APH_2
  Top 0.203: U$3.24 52.72,25.64 45.21,33.15 40.01,33.15 36.07,37.08 36.07,41.75 IC1.4
BEN_1  (via drill 0.33)
  Top 0.203: 34.42,37.97 v34.67,37.97 32.26,37.97 22.16,27.88 U$2.21 | v40.01,39.24 40.01,41.81 IC1.9
  Bottom 0.203: v34.67,37.97 38.73,37.97 v40.01,39.24
BEN_2
  Top 0.203: U$3.21 54.67,28 41.59,41.09 IC1.11
BPH_1
  Top 0.203: IC1.3 35.19,39.51 34.16,38.48 32,38.48 21.51,27.99 U$2.22
BPH_2  (via drill 0.33)
  Top 0.203: 36.83,41.02 36.83,41.79 IC1.5 36.79,37.76 40.89,33.66 45.74,33.66 v49.17,30.23 | U$3.22 54.02,27.51 v52.45,29.08
  Bottom 0.203: v52.45,29.08 50.32,29.08 v49.17,30.23
GND  (via drill 0.33)
  Top 0.203: C10.2 26.98,14.28 27.05,14.35 | U$2.12 24.76,18.79 24.77,18.8 | LED1.C LED2.C LED3.C 68.85,3.69 v68.83,3.68 68.27,4.25 C6.2 | C3.2 v93.6,10.03 | C4.2 19.94,69.72 v19.81,69.6 | 29.4,53.72 29.4,52.38 v29.97,51.82 | C5.2 3.87,9.47 J1.1 | C19.2 v2.41,31.5 1.27,32.64 LED4.C | C20.2 v2.41,64.9 | LED5.C 23.37,61.35 v23.37,60.33
  Top 0.305: C1.2 v46.09,38.99 v46.1,38.99 | C2.2 29.4,53.72 | IC1.29 36.79,54.7 v37.08,54.99 | IC1.6 37.59,43.31 v37.08,43.81
  Top 0.33: TOUCH_RESET.P$4 74.83,21.97 v78.74,21.97 78.78,21.93 TOUCH_RESET.P$1
  other vias: 8.38,18.29 8.38,21.72 8.26,24 11.05,24 13.84,24 16.13,24 21.84,20.7 23.62,21.59 23.62,19.81 19.94,19.81 19.94,21.59 17.91,19.81 17.91,21.97 25.53,21.97 25.53,19.56 15.75,19.68 15.75,22.1 10.92,20.57 12.06,21.72 15.75,8.76 10.03,8.89 32.26,18.41 38.23,18.41 40.51,18.29 40.51,21.72 40.26,24.89 46.35,24.89 50.55,19.81 50.55,21.97 48.39,19.68 48.39,22.1 44.7,21.72 43.31,20.57 43.43,24.89 56.13,21.59 56.13,19.81 58.04,21.97 58.04,19.56 54.48,20.7 52.58,19.81 52.58,21.46 61.34,15.75
  pour Bottom (isolate 0.254, rank 6, no thermals): -0.75,103.25 109.75,103.25 109.75,-6 -0.75,-6
  pour Top (isolate 0.254, rank 6, no thermals): 7.75,26.16 7.75,8.13 67.56,8.13 67.56,26.16
ICDCLK  (via drill 0.33)
  Top 0.203: JP11.5 79.63,9.78 75.56,13.84 69.47,13.84 68.71,14.61 68.71,39.37 v61.21,46.86 | IC1.16 47.16,46.83 48.39,45.59 v48.64,45.59
  Bottom 0.203: v61.21,46.86 49.91,46.86 v48.64,45.59
ICDDAT  (via drill 0.33)
  Top 0.203: JP11.4 82.17,8.13 75.95,14.35 69.98,14.35 69.22,15.11 69.22,40.39 61.59,48.01 v59.94,48.01 | IC1.17 47.5,47.62 v48.13,46.99
  Bottom 0.203: v59.94,48.01 49.15,48.01 v48.13,46.99
MCLR
  Top 0.203: C3.1 89.79,9.97 JP11.1 92.71,4.57 94.49,6.35 94.49,15.37 92.42,17.43 TOUCH_RESET.P$2 TOUCH_RESET.P$3 | R5.1 89.75,10.13 C3.1 | C3.1 89.86,12.23 R4.2
MCLR`  (via drill 0.33)
  Top 0.203: R4.1 70.46,15.14 69.72,15.88 69.72,40.64 61.21,49.15 v58.8,49.15 | v46.23,48.39 43.43,48.39 IC1.18
  Bottom 0.203: v58.8,49.15 46.99,49.15 v46.23,48.39
MOTOR1A_1
  Top 0.33: U$2.5 20.21,15.01 18.8,13.59 18.8,9.65 MOTORA_1.2
MOTOR1A_2
  Top 0.33: U$2.7 21.51,9.83 MOTORA_1.1
MOTOR1B_1
  Top 0.33: U$2.8 22.16,10.48 24.13,8.51 28.07,8.51 30.1,6.48 MOTORB_1.2
MOTOR1B_2
  Top 0.33: U$2.10 23.46,15.02 24.77,13.72 24.77,11.05 26.67,9.14 28.57,9.14 MOTORB_1.1
MOTOR2A_1
  Top 0.33: U$3.5 52.72,14.75 51.31,13.34 51.31,10.41 MOTORA_2.2
MOTOR2A_2
  Top 0.33: U$3.7 54.02,10.59 MOTORA_2.1
MOTOR2B_1
  Top 0.33: U$3.8 54.67,10.22 56.64,8.26 60.07,8.26 61.72,6.6 61.72,5.21 MOTORB_2.2
MOTOR2B_2
  Top 0.33: U$3.10 55.97,14.64 57.28,13.34 57.28,10.16 58.42,9.02 60.45,9.02 MOTORB_2.1
N$1
  Top 0.203: LED3.A R1.1
N$2
  Top 0.203: JP12.1 32.11,28.32 R18.1
N$3
  Top 0.203: R19.1 60.98,32.16 JP13.1
N$4
  Top 0.33: U$2.9 22.81,13.03 R7.1
N$5
  Top 0.203: R20.1 LED5.A
N$6
  Top 0.203: LED2.A R2.1
N$7
  Top 0.203: LED1.A R3.1
N$8
  Top 0.203: R21.1 1.27,35.59 LED4.A
N$11
  Top 0.33: U$2.6 20.86,13.17 R6.1
N$16
  Top 0.203: U$2.2 18.26,18.44 18.16,18.54 16.45,18.54 C7.2
N$17
  Top 0.203: C7.1 16.91,16.89 U$2.1
N$19
  Top 0.203: U$2.3 18.91,16.75 18.54,16.38 17.98,16.38 C8.1
N$20
  Top 0.203: U$2.13 U$2.14 27.54,17.59 R9.1 R8.2
N$21
  Top 0.33: U$3.9 55.32,13.03 R12.1
N$22
  Top 0.33: U$3.6 53.37,13.04 R11.1
N$27
  Top 0.33: U$3.2 50.77,18.31 50.55,18.54 48.96,18.54 C13.2
N$28
  Top 0.33: U$3.1 49.31,17.59 C13.1
N$29
  Top 0.33: U$3.3 51.42,16.88 50.93,16.38 50.49,16.38 C14.1
N$30
  Top 0.203: U$3.13 U$3.14 60.05,17.59 R14.1 R13.2
NFAULT_1  (via drill 0.33)
  Top 0.203: U$2.18 24.11,26.73 | 24.11,26.73 R10.1 | 24.11,26.73 24.11,28.81 v32.51,37.21 | v46.61,37.21 47.12,37.21 48.26,38.35 48.26,42.42 45.47,45.21 43.41,45.21 IC1.14
  Bottom 0.203: v32.51,37.21 v46.61,37.21
NFAULT_2
  Top 0.203: U$3.18 56.62,26.73 R15.1 56.18,36.53 46.74,45.97 43.44,45.97 IC1.15
NSLEEP_1  (via drill 0.33)
  Top 0.203: R3.2 72.42,13.34 69.09,13.34 68.2,14.22 68.2,37.47 v65.02,40.64 47.24,58.42 38.48,58.42 v37.59,57.53 | v38.35,51.05 38.35,53.39 IC1.27 | U$2.17 24.76,25.78 25.02,26.04 25.02,28.32 27.56,30.86 JP12.2 30.73,32.38 v44.7,32.38 | v51.56,32.38 v55.37,36.2
  Bottom 0.203: v37.59,57.53 37.59,56.13 38.1,55.63 38.1,51.31 v38.35,51.05 | v44.7,32.38 v51.56,32.38 | v55.37,36.2 59.82,40.64 v65.02,40.64
NSLEEP_2  (via drill 0.33)
  Top 0.203: R2.2 72.26,12.06 71.5,12.83 68.83,12.83 67.69,13.97 67.69,36.83 v66.67,37.85 46.61,57.91 39.37,57.91 v38.73,57.28 | v38.86,54.99 39.19,54.66 IC1.26 | U$3.17 57.27,25.65 57.66,26.04 57.66,28.7 57.4,28.96 57.4,32.13 57.91,32.64 JP13.2
  Bottom 0.203: v38.73,57.28 38.73,55.12 v38.86,54.99 | JP13.2 64.14,37.85 v66.67,37.85
OUT0
  Top 0.203: IC1.36 29.6,50.02 16.51,63.12 16.51,70.87 OUT0.3
OUT1
  Top 0.203: IC1.37 29.39,49.23 15.88,62.74 15.88,65.91 OUT1.3
OUT2
  Top 0.203: IC1.38 28.57,48.42 28.16,48.42 27.77,48.42 OUT2.3
OUT3
  Top 0.203: IC1.39 24.64,47.62 24,47.62 22.99,47.62 OUT3.3
OUT4
  Top 0.203: IC1.40 18.2,46.83 OUT4.3
OUT5
  Top 0.203: IC1.41 13.41,46.02 OUT5.3
OUT6
  Top 0.203: IC1.42 13.35,45.23 11.43,43.31 10.54,43.31 OUT6.3
OUT7
  Top 0.203: IC1.43 13.18,44.42 OUT7.3
OUT8
  Top 0.203: IC1.44 18.99,43.62 12.06,36.7 9.27,36.7 8.51,35.94 OUT8.3
OUT9
  Top 0.203: IC1.1 22.27,41.83 11.68,31.24 9.53,31.24 8.51,30.23 OUT9.3
QEIA1_1  (via drill 0.33)
  Top 0.203: IC1.20 47.51,50.02 63.63,33.91 63.63,13.84 v60.07,10.29
  Bottom 0.203: v60.07,10.29 9.78,10.29 6.6,7.11 MOTORA_1.5
QEIA1_2  (via drill 0.33)
  Top 0.203: IC1.19 47.04,49.23 63.12,33.15 63.12,26.92 63.12,25.02 63.12,14.48 v60.96,12.32
  Bottom 0.203: v60.96,12.32 59.44,10.79 8.26,10.79 4.06,6.6 MOTORA_1.6
QEIA2_1  (via drill 0.33)
  Top 0.203: v64.01,8.51 65.66,10.16 65.66,35.18 45.85,54.99 41.02,54.99 40.79,54.76 IC1.24
  Bottom 0.203: MOTORA_2.5 38.35,6.22 40.13,8 63.5,8 v64.01,8.51
QEIA2_2  (via drill 0.33)
  Top 0.203: v63.25,9.27 65.15,11.18 65.15,34.92 46.65,53.42 IC1.23
  Bottom 0.203: MOTORA_2.6 35.81,6.35 37.97,8.51 62.48,8.51 v63.25,9.27
QEIB1_1  (via drill 0.33)
  Top 0.203: IC1.22 47.69,51.62 64.64,34.67 64.64,12.19 v62.48,10.03
  Bottom 0.203: MOTORB_1.5 22.48,6.1 25.4,9.02 61.47,9.02 v62.48,10.03
QEIB1_2  (via drill 0.33)
  Top 0.203: IC1.21 47.6,50.83 64.14,34.29 64.14,13.21 v61.72,10.79
  Bottom 0.203: MOTORB_1.6 19.94,6.22 23.24,9.53 60.45,9.53 v61.72,10.79
QEIB2_1  (via drill 0.33)
  Top 0.203: IC1.31 35.19,55.51 36.07,56.39 45.97,56.39 66.67,35.69 66.67,8 v65.66,6.99
  Bottom 0.203: v65.66,6.99 54.86,6.99 54.23,6.35 MOTORB_2.5
QEIB2_2  (via drill 0.33)
  Top 0.203: IC1.30 35.99,55.42 36.45,55.88 45.72,55.88 66.17,35.43 66.17,9.14 v64.77,7.75
  Bottom 0.203: MOTORB_2.6 51.69,6.22 52.96,7.49 64.52,7.49 v64.77,7.75
SCL
  Top 0.203: X1.5 26.01,73.45 R16.2 27.15,73.43 27.69,72.9 JP2.2 27.69,52.7 29.57,50.83 IC1.35
SDA
  Top 0.203: X1.3 23.47,73.45 R17.1 23.5,77.98 24.13,78.61 26.92,78.61 27.3,78.23 27.3,73.79 28.19,72.9 28.19,65.53 JP2.1 34.42,59.31 34.42,53.45 IC1.32
STATUS1  (via drill 0.33)
  Top 0.203: R1.2 69.83,11.07 67.18,13.72 67.18,35.94 45.97,57.15 v40.26,57.15 | v40.13,55.12 39.99,54.98 IC1.25
  Bottom 0.203: v40.26,57.15 40.26,55.24 v40.13,55.12
TRQ0  (via drill 0.33)
  Top 0.203: U$2.27 18.26,26.01 v18.67,26.42 | v27.94,26.67 v33.15,26.67 | U$3.27 50.53,23.77 v49.15,25.15 | v47.88,26.42 40.89,26.42 JP1.3
  Bottom 0.203: v18.67,26.42 27.69,26.42 v27.94,26.67 | v33.15,26.67 38.1,26.67 JP1.3 | v49.15,25.15 v47.88,26.42
TRQ1  (via drill 0.33)
  Top 0.203: U$2.26 18.91,25.77 19.68,26.54 19.68,28.83 v24,33.15 | v33.78,31.88 38.73,31.88 39.37,31.24 JP1.4 40.64,29.21 46.48,29.21 v49.28,26.42 | U$3.26 51.42,24.27 v50.55,25.15
  Bottom 0.203: v24,33.15 32.51,33.15 v33.78,31.88 | v50.55,25.15 v49.28,26.42
V3P3_1  (via drill 0.33)
  Top 0.203: R10.2 26.54,27.18 26.06,26.7 26.06,25.06 | v29.97,18.67 29.06,18.67 R8.1 | 26.06,25.06 C11.1 | 26.06,25.06 U$2.15 26.54,23.29 v26.54,22.1
  Bottom 0.203: v26.54,22.1 v29.97,18.67
V3P3_2
  Top 0.203: 58.57,25.27 U$3.15 58.59,23.75 59.56,23.75 61.51,21.8 R13.1 | 58.57,25.27 58.57,26.73 R15.2 59.02,27.09 59.05,27.05 | C17.1 58.66,25.18 58.57,25.27

### Text on the board
tNames: GND | +5V | CH | EN | NCSU Robotics Club | I2C test | QEI1 | QEI2 | +5V | GND | MOTOR_OUTA | MOTOR_OUTB